# EAGLE design nano (EAGLE 7.1.0)
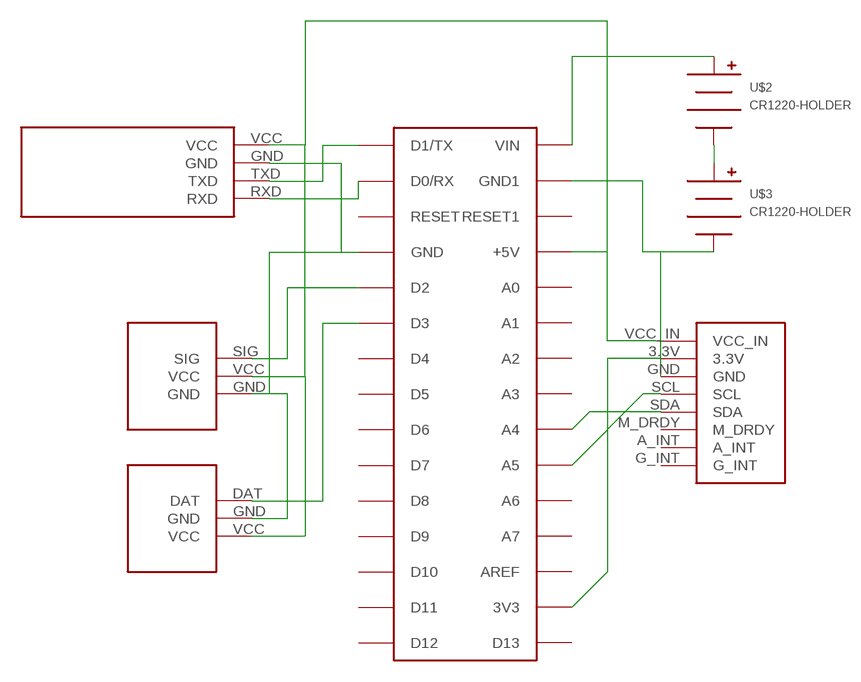
[diagram p0: schematic, sheet 1]

## Parts
U$1  ARDUINONANO  [PDIP-32]
U$2  CR1220-HOLDER  [HARWIN-CR1220]
U$3  CR1220-HOLDER  [HARWIN-CR1220]
U$4  GY85  [GY85]
U$5  HC06  [HC06]
U$6  KEY  [KEY]
U$7  KEY_SMALL  [KEY_SMALL]

## Nets
N$1: U$1.D2 U$6.SIG
N$2: U$1.D3 U$7.DAT
N$3: U$5.VCC U$6.VCC U$7.VCC
N$4: U$1.GND U$5.GND U$6.GND U$7.GND
N$5: U$1.D1/TX U$5.TXD
N$6: U$1.D0/RX U$5.RXD
N$7: U$2.NEG U$3.POS
N$8: U$1.VIN U$2.POS
N$9: U$1.GND1 U$3.NEG U$4.GND
N$10: U$1.+5V U$4.VCC_IN
N$11: U$1.3V3 U$4.3.3V
N$12: U$1.A5 U$4.SCL
N$13: U$1.A4 U$4.SDA
Unconnected: U$1.A0 U$1.A1 U$1.A2 U$1.A3 U$1.A6 U$1.A7 U$1.AREF U$1.D4 U$1.D5 U$1.D6 U$1.D7 U$1.D8 U$1.D9 U$1.D10 U$1.D11 U$1.D12 U$1.D13 U$1.RESET U$1.RESET1 U$4.A_INT U$4.G_INT U$4.M_DRDY

## Library data of the parts
U$1 = jet-lib:ARDUINONANO
U$2 U$3 = battery-holder:CR1220-HOLDER
U$4 = RMQLIFE:GY85: gy85, accelerator, gyrometer, magmeter
U$5 = RMQLIFE:HC06: bluetooth slave
U$6 = RMQLIFE:KEY: touch key
U$7 = RMQLIFE:KEY_SMALL: Small key

## Board
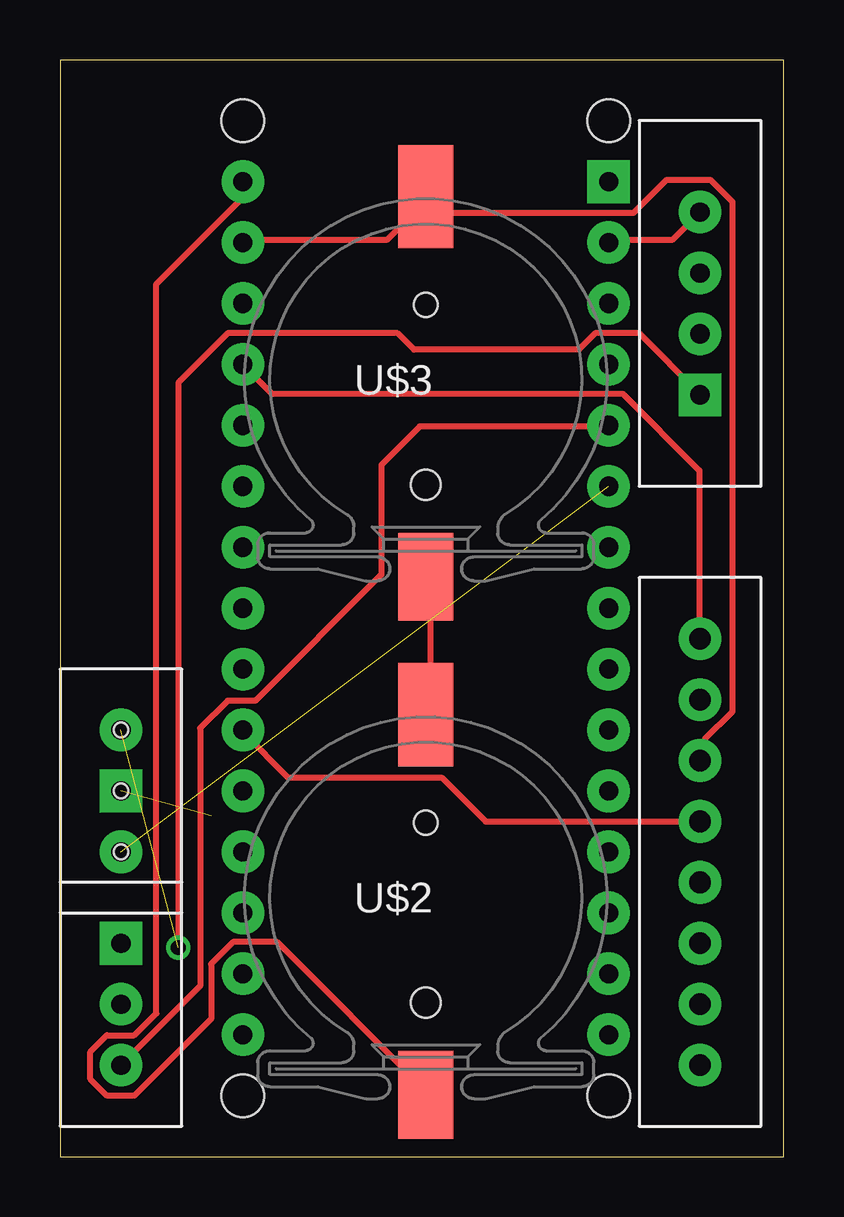
[diagram p1: board, top side]
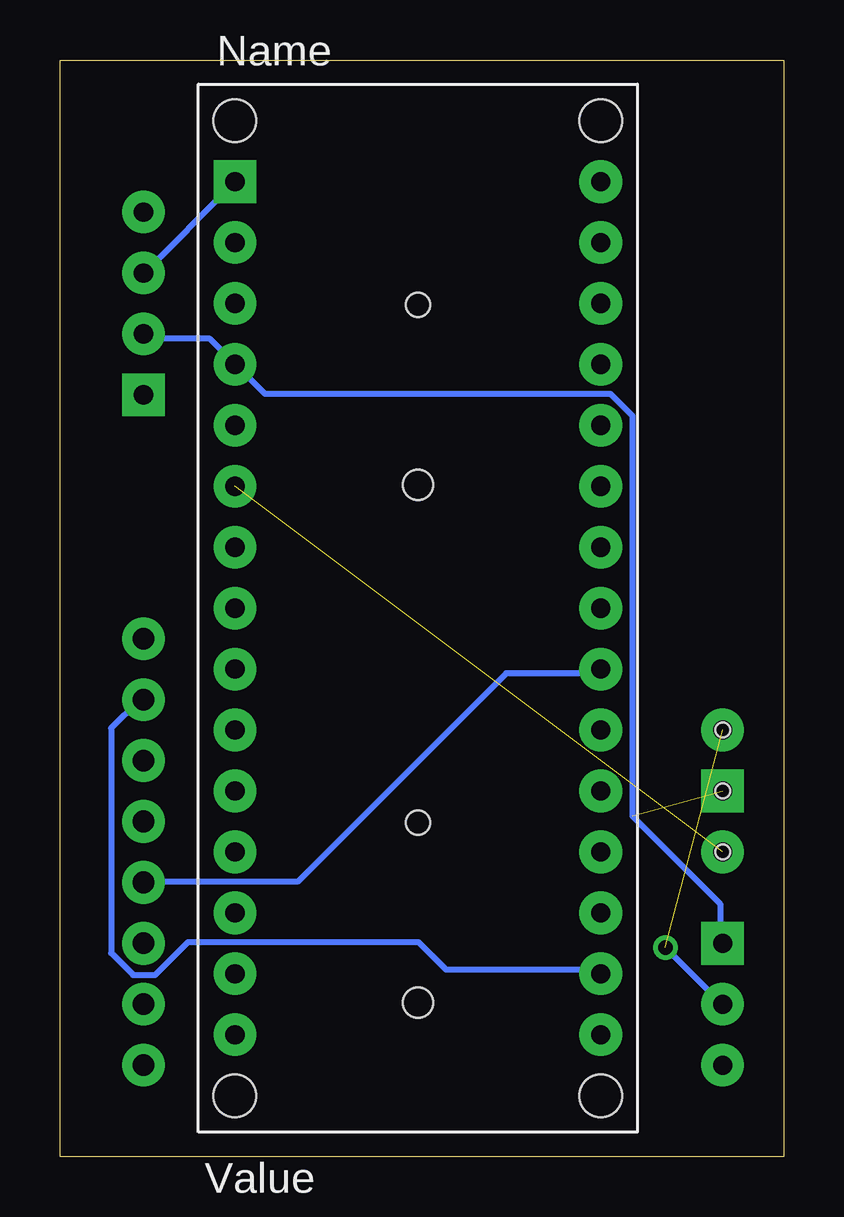
[diagram p2: board, bottom side, seen from below]

Size 30.15 x 45.71 mm. Coordinates in mm from the lower left corner, seen from the top.
Outline: 0,0 30.15,0 30.15,45.71 0,45.71 0,0
Copper layers (1*16): Top 0.035mm / dielectric 1.5mm / Bottom 0.035mm
Design rules "default": minimum track width 10mil, minimum drill 24mil, track to track 8mil, track to pad 8mil, pad to pad 8mil, via to via 8mil, smd to smd 8mil, copper to edge 40mil, drill to drill 8mil, minimum pad ring 10mil, minimum via ring 8mil, stop-mask expansion 4mil, vias tented up to drill 0mil, thermal gap 10mil

### Footprints (pad centres in the part's own frame; a part is rotated, then mirrored left to right if it is on the bottom)
PDIP-32 = drill 0.8 pad 1.778: 3V3 15.24,-35.56; +5V 15.24,-10.16; A0 15.24,-12.7; A1 15.24,-15.24; A2 15.24,-17.78; A3 15.24,-20.32; A4 15.24,-22.86; A5 15.24,-25.4; A6 15.24,-27.94; A7 15.24,-30.48; AREF 15.24,-33.02; D0/RX 0,-5.08; D2 0,-12.7; D3 0,-15.24; D4 0,-17.78; D5 0,-20.32; D6 0,-22.86; D7 0,-25.4; D8 0,-27.94; D9 0,-30.48; D10 0,-33.02; D11 0,-35.56; D12 0,-38.1; D13 15.24,-38.1; GND 0,-10.16; GND1 15.24,-5.08; RESET 0,-7.62; RESET1 15.24,-7.62; VIN 15.24,-2.54 | drill 0.8 pad 1.778 square: D1/TX 0,-2.54 | hole 1.778: 0,0; 0,-40.64; 15.24,-40.64; 15.24,0
HARWIN-CR1220 = smd 2.3 x 4.3: NEG 0,8.26 | smd 2.3 x 3.66: POS 0,-7.58 | hole 1: 0,3.75 | hole 1.25: 0,-3.75
GY85 = drill 0.9 pad 1.778: 3.3V 0,6.35; A_INT 0,-6.35; G_INT 0,-8.89; GND 0,3.81; M_DRDY 0,-3.81; SCL 0,1.27; SDA 0,-1.27; VCC_IN 0,8.89
HC06 = drill 0.8 pad 1.778: GND 0,-2.54; RXD 0,2.54; TXD 0,0 | drill 0.8 pad 1.778 square: VCC 0,-5.08
KEY = drill 0.8 pad 1.778 square: GND 0,2.54 | drill 0.8 pad 1.778: SIG 0,-2.54; VCC 0,0
KEY_SMALL = drill 0.8 pad 1.778: DAT 0,-2.54; VCC 0,2.54 | drill 0.8 pad 1.778 square: GND 0,0 | hole 0.6: 0,2.54; 0,0; 0,-2.54

### Placement (x,y rotation side)
U$1  22.86,43.18 0 bottom
U$2  15.24,10.16 0 top
U$3  15.24,31.75 0 top
U$4  26.67,12.7 0 top
U$5  26.67,36.83 0 top
U$6  2.54,6.35 0 top
U$7  2.54,15.24 0 top

### Tracks (layer width: path | path; a pad name or v marks a point on that pad's centre or on a via)
N$1
  Top 0.254: U$6.SIG 5.84,7.11 5.84,17.86 6.98,19 8.13,19 13.39,24.26 13.39,28.83 14.99,30.43 22.76,30.43 U$1.D2
N$2  (1 unrouted)
N$3  (via drill 0.61)  (1 unrouted)
  Top 0.254: v4.93,8.71 4.93,32.26 6.98,34.31 14.07,34.31 14.76,33.63 21.61,33.63 22.3,34.31 24.13,34.31 26.64,31.8 U$5.VCC
  Bottom 0.254: v4.93,8.71 2.64,6.43 U$6.VCC
N$4  (1 unrouted)
  Bottom 0.254: U$6.GND 2.64,8.94 2.64,10.54 6.3,14.2 6.3,30.89 7.21,31.8 21.61,31.8 22.76,32.94 U$1.GND 22.99,33.17 23.9,34.09 26.64,34.09 U$5.GND
N$5
  Bottom 0.254: U$5.TXD 26.64,36.83 22.99,40.49 U$1.D1/TX
N$6
  Top 0.254: U$5.RXD 25.5,38.2 22.99,38.2 U$1.D0/RX
N$7
  Top 0.254: U$3.POS 15.44,24.03 15.44,18.54 U$2.NEG
N$8
  Top 0.254: U$1.VIN 7.44,40.49 7.44,39.8 4.01,36.37 4.01,5.97 3.1,5.05 1.96,5.05 1.27,4.37 1.27,3.23 1.96,2.54 3.1,2.54 6.3,5.74 6.3,8.03 7.21,8.94 9.04,8.94 15.21,2.77 U$2.POS
N$9
  Top 0.254: U$4.GND 26.87,16.71 26.87,17.4 28.02,18.54 28.02,39.8 27.1,40.72 25.27,40.72 23.9,39.34 15.9,39.34 15.44,39.8 U$3.NEG 15.21,39.8 13.61,38.2 7.67,38.2 U$1.GND1
N$10
  Top 0.254: U$4.VCC_IN 26.64,21.74 26.64,28.6 23.44,31.8 8.81,31.8 7.67,32.94 U$1.+5V
N$11
  Bottom 0.254: U$1.3V3 7.67,7.8 14.07,7.8 15.21,8.94 24.82,8.94 26.19,7.57 27.1,7.57 28.02,8.48 28.02,17.86 26.87,19 U$4.3.3V
N$12
  Top 0.254: U$4.SCL 17.73,13.97 15.9,15.8 9.5,15.8 7.67,17.63 U$1.A5
N$13
  Bottom 0.254: U$4.SDA 26.64,11.45 20.24,11.45 11.56,20.14 7.67,20.14 U$1.A4